# Altium schematic sheet MQTT_SelService_V2.SchDoc
size 419 x 327 mm
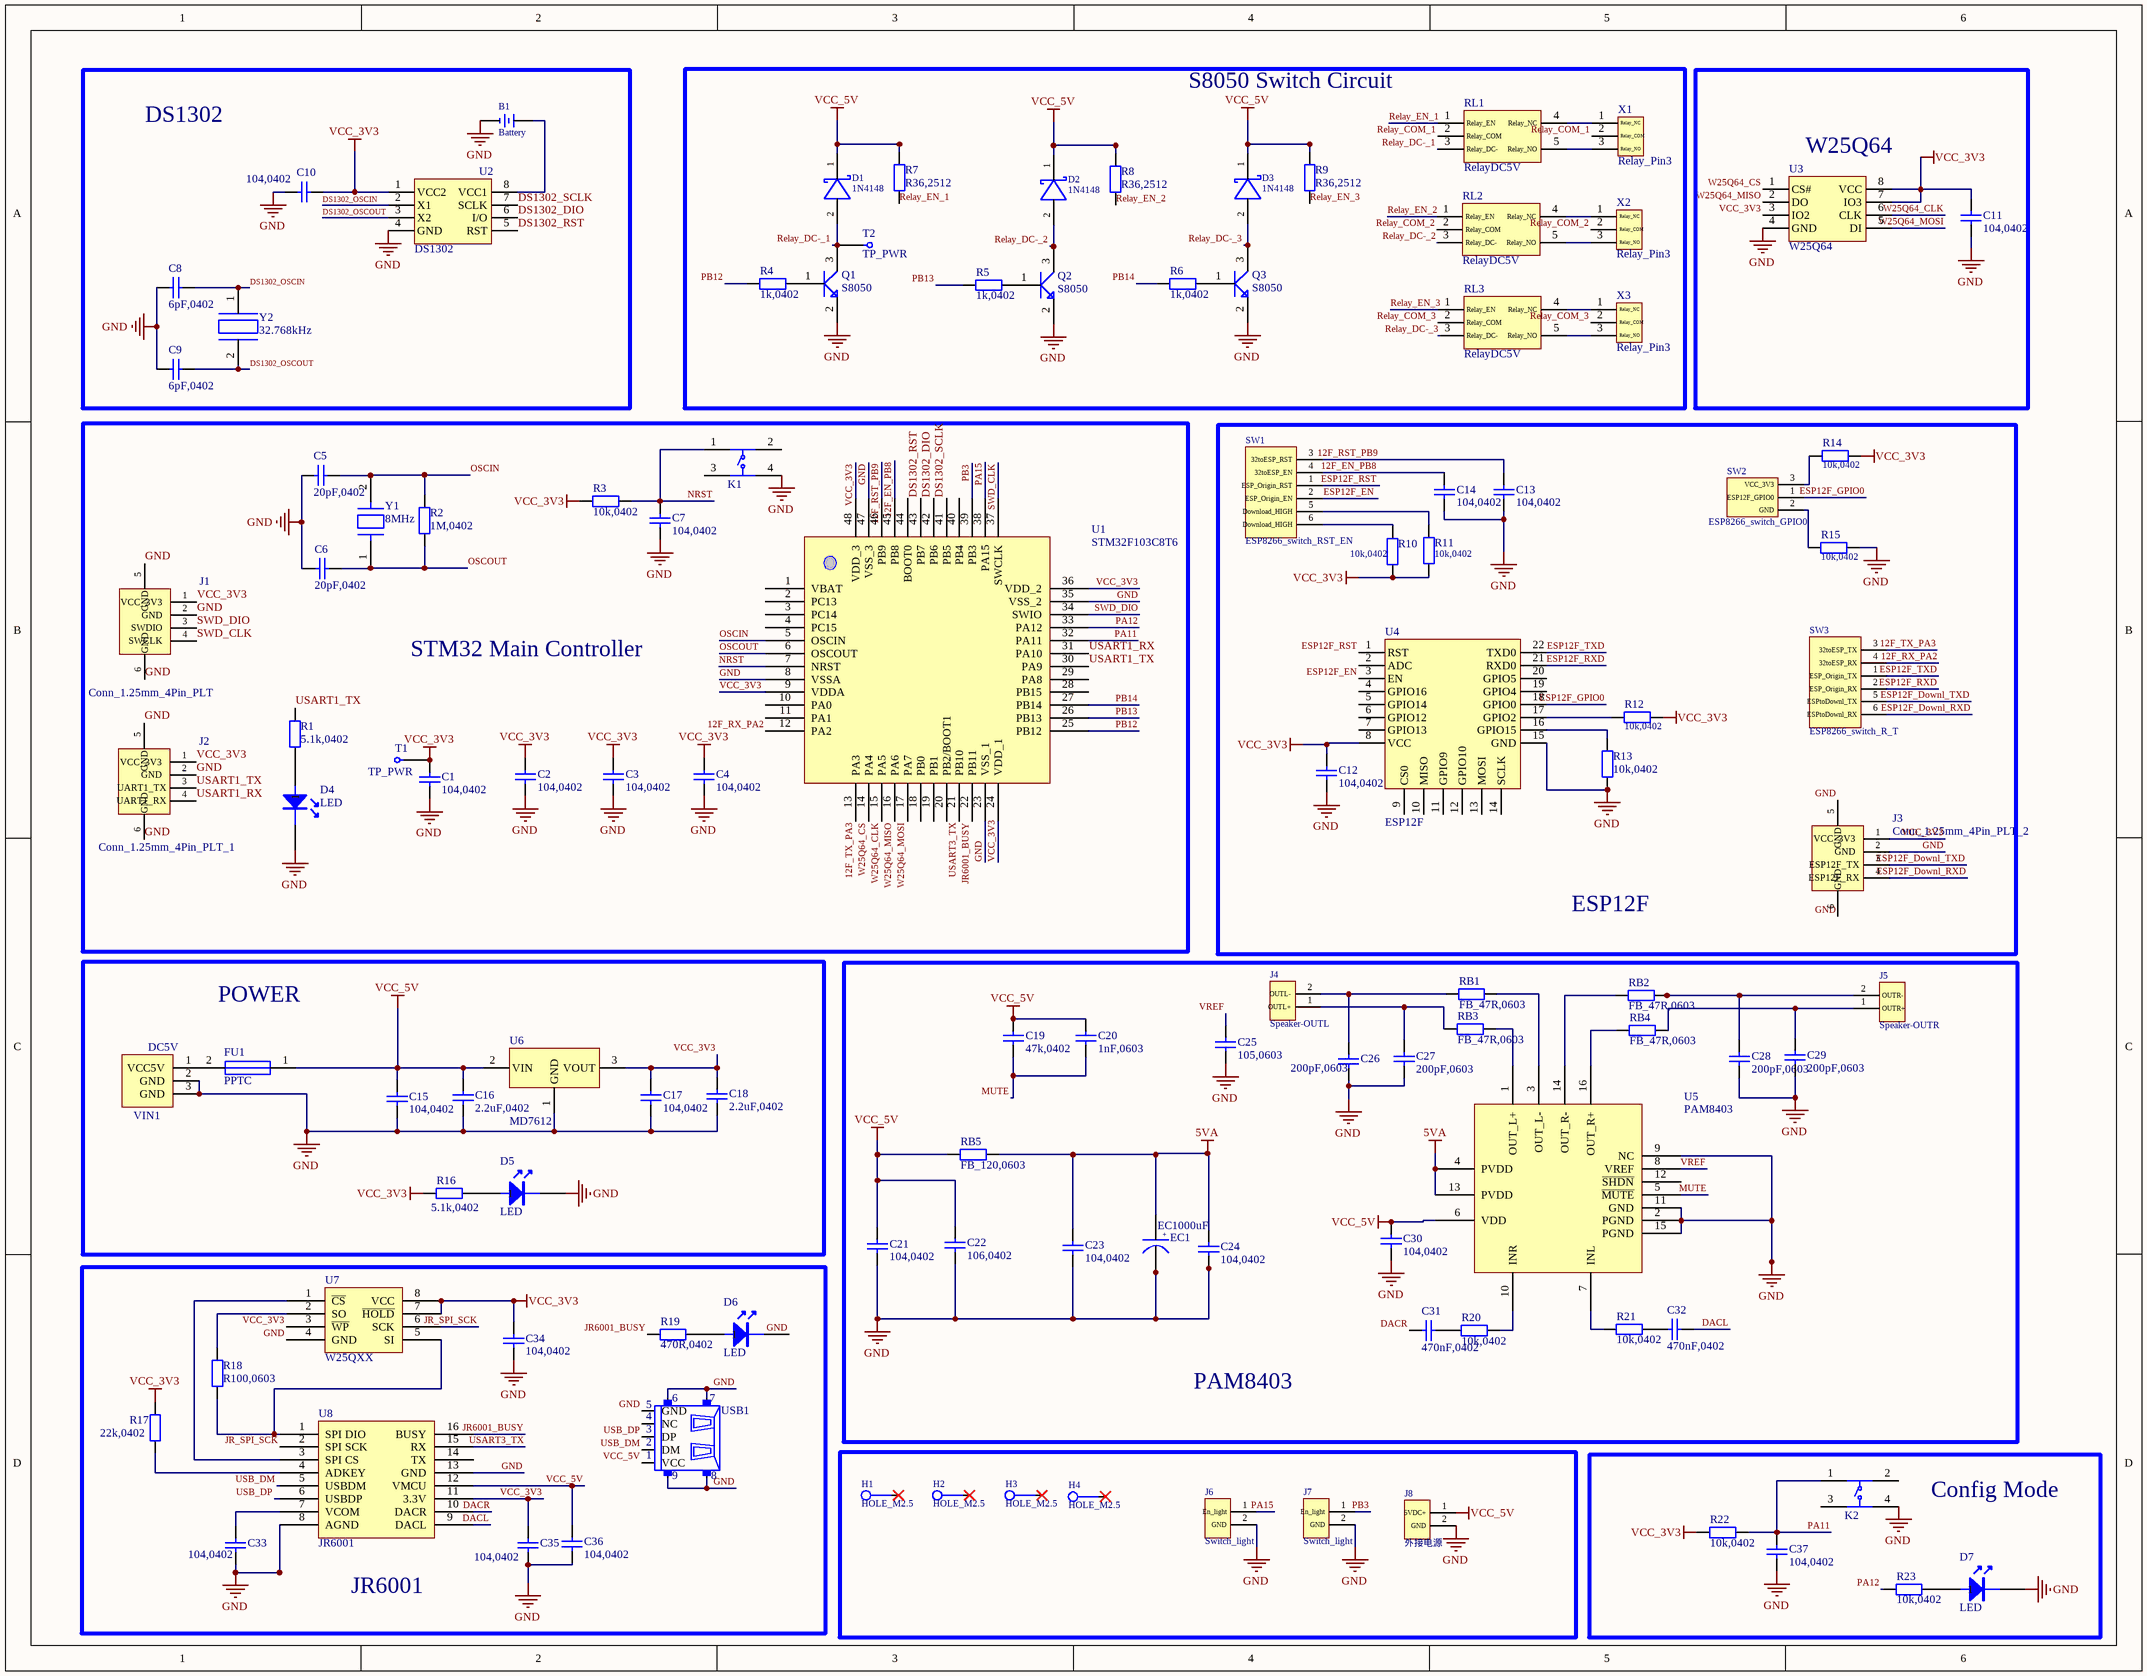
[diagram p0: MQTT_SelService_V2.SchDoc]

## Parts
B1  Battery  [Battery]
C1  104,0402  [C0402]
C2  104,0402  [C0402]
C3  104,0402  [C0402]
C4  104,0402  [C0402]
C5  20pF,0402  [C0402]
C6  20pF,0402  [C0402]
C7  104,0402  [C0402]
C8  6pF,0402  [C0402]
C9  6pF,0402  [C0402]
C10  104,0402  [C0402]
C11  104,0402  [C0402]
C12  104,0402  [C0402]
C13  104,0402  [C0402]
C14  104,0402  [C0402]
C15  104,0402  [C0402]
C16  2.2uF,0402  [C0402]
C17  104,0402  [C0402]
C18  2.2uF,0402  [C0402]
C19  47k,0402  [C0402]
C20  1nF,0603  [C0603]
C21  104,0402  [C0402]
C22  106,0402  [C0402]
C23  104,0402  [C0402]
C24  104,0402  [C0402]
C25  105,0603  [C0603]
C26  200pF,0603  [C0603]
C27  200pF,0603  [C0603]
C28  200pF,0603  [C0603]
C29  200pF,0603  [C0603]
C30  104,0402  [C0402]
C31  470nF,0402  [C0402]
C32  470nF,0402  [C0402]
C33  104,0402  [C0402]
C34  104,0402  [C0402]
C35  104,0402  [C0402]
C36  104,0402  [C0402]
C37  104,0402  [C0402]
D1  1N4148  [1N4148]
D2  1N4148  [1N4148]
D3  1N4148  [1N4148]
D4  LED  [LED0603]
D5  LED  [LED0603]
D6  LED  [LED0603]
D7  LED  [LED0603]
EC1  EC1000uF  [EC1000uF]
FU1  PPTC  [F0805]
H1  HOLE_M2.5  [hole]
H2  HOLE_M2.5  [hole]
H3  HOLE_M2.5  [hole]
H4  HOLE_M2.5  [hole]
J1  Conn_1.25mm_4Pin_PLT  [CONN-SMD_4P-P1.25_HCTL_HC-1.25-4PLT]
J2  Conn_1.25mm_4Pin_PLT_1  [CONN-SMD_4P-P1.25_HCTL_HC-1.25-4PLT]
J3  Conn_1.25mm_4Pin_PLT_2  [CONN-SMD_4P-P1.25_HCTL_HC-1.25-4PLT]
J4  Speaker-OUTL  [XH_2.54mm_2Pin_直插]
J5  Speaker-OUTR  [XH_2.54mm_2Pin_直插]
J6  Switch_light  [XH_2.54mm_2Pin_直插]
J7  Switch_light  [XH_2.54mm_2Pin_直插]
J8  外接电源  [XH_2.54mm_2Pin_直插]
K1  TS665CJ  [SW-TH_4P-L6.0-W6.0-P4.50-LS6.5]  (value not drawn)
K2  TS665CJ  [SW-TH_4P-L6.0-W6.0-P4.50-LS6.5]  (value not drawn)
Q1  S8050  [S8050]
Q2  S8050  [S8050]
Q3  S8050  [S8050]
R1  5.1k,0402  [R0402]
R2  1M,0402  [R0402]
R3  10k,0402  [R0402]
R4  1k,0402  [R0402]
R5  1k,0402  [R0402]
R6  1k,0402  [R0402]
R7  R36,2512  [R2512]
R8  R36,2512  [R2512]
R9  R36,2512  [R2512]
R10  10k,0402  [R0402]
R11  10k,0402  [R0402]
R12  10k,0402  [R0402]
R13  10k,0402  [R0402]
R14  10k,0402  [R0402]
R15  10k,0402  [R0402]
R16  5.1k,0402  [R0402]
R17  22k,0402  [R0402]
R18  R100,0603  [R0603]
R19  470R,0402  [R0402]
R20  10k,0402  [R0402]
R21  10k,0402  [R0402]
R22  10k,0402  [R0402]
R23  10k,0402  [R0402]
RB1  FB_47R,0603  [R0603]
RB2  FB_47R,0603  [R0603]
RB3  FB_47R,0603  [R0603]
RB4  FB_47R,0603  [R0603]
RB5  FB_120,0603  [R0603]
RL1  RelayDC5V  [RelayDC5V]
RL2  RelayDC5V  [RelayDC5V]
RL3  RelayDC5V  [RelayDC5V]
SW1  ESP8266_switch_RST_EN  [switch_TX_RX_toDownload]
SW2  ESP8266_switch_GPIO0  [switch_GPIO0_ESP]
SW3  ESP8266_switch_R_T  [switch_TX_RX_toDownload]
T1  TP_PWR  [TP_PWR]
T2  TP_PWR  [TP_PWR]
U1  STM32F103C8T6  [LQFP-48_L7.0-W7.0-P0.50-LS9.0-BL]
U2  DS1302  [DS1302]
U3  W25Q64  [W25Q64]
U4  ESP12F  [ESP-12E]
U5  PAM8403  [SO-16]
U6  MD7612  [MD71612A]
U7  W25QXX  [W25Qxx]
U8  JR6001  [JR6001]
USB1  USB-5PIN  [MICRO-USB-SMD_MICROXNJ]  (value not drawn)
VIN1  DC5V  [DC5V]  (value not drawn)
X1  Relay_Pin3  [Relay_Pin3_X]
X2  Relay_Pin3  [Relay_Pin3_X]
X3  Relay_Pin3  [Relay_Pin3_X]
Y1  8MHz  [8MHz]
Y2  32.768kHz  [32768Hz]

## Blocks framed on the sheet
DS1302: B1 C8-C10 U2 Y2
S8050 Switch Circuit: D1-D3 Q1-Q3 R4-R9 RL1-RL3 T2 X1-X3
W25Q64: C11 U3
STM32 Main Controller: C1-C7 D4 J1 J2 K1 R1-R3 T1 U1 Y1
ESP12F: C12-C14 J3 R10-R15 SW1-SW3 U4
POWER: C15-C18 D5 FU1 R16 U6 VIN1
PAM8403: C19-C32 EC1 J4 J5 R20 R21 RB1-RB5 U5
JR6001: C33-C36 D6 R17-R19 U7 U8 USB1
Config Mode: C37 D7 K2 R22 R23

## Nets
5VA: C23.2 C24.2 EC1.1 RB5.2 U5.4(PVDD) U5.13(PVDD)
GND: B1.2 C1.1 C2.1 C3.1 C4.1 C5.1 C6.1 C7.1 C8.1 C9.1 C10.1 C11.1 C12.1 C13.1 C14.1 C15.1 C16.1 C17.1 C18.1 C21.1 C22.1 C23.1 C24.1 C25.1 C26.1 C27.1 C28.1 C29.1 C30.1 C33.2 C34.1 C35.1 C36.1 C37.1 D4.2 D5.2 D6.2 D7.2 EC1.2 J1.2(GND) J1.5(GND) J1.6(GND) J2.2(GND) J2.5(GND) J2.6(GND) J3.2(GND) J3.5(GND) J3.6(GND) J6.2(GND) J7.2(GND) J8.2(GND) K1.4 K2.4 Q1.2 Q2.2 Q3.2 R13.1 R15.2 U1.8(VSSA) U1.23(VSS_1) U1.35(VSS_2) U1.47(VSS_3) U2.4(GND) U3.4(GND) U4.15(GND) U5.2(PGND) U5.9(NC) U5.11(GND) U5.15(PGND) U6.1(GND) U7.4(GND) U8.8(AGND) U8.13(GND) USB1.5(GND) USB1.6 USB1.7 USB1.8 USB1.9 VIN1.2(GND) VIN1.3(GND)
VCC_3V3: C1.2 C2.2 C3.2 C4.2 C10.2 C11.2 C12.2 C17.2 C18.2 C34.2 C35.2 J1.1(VCC_3V3) J2.1(VCC_3V3) J3.1(VCC_3V3) R3.2 R10.1 R11.1 R12.2 R14.2 R16.1 R17.2 R22.2 T1.1 U1.9(VDDA) U1.24(VDD_1) U1.36(VDD_2) U1.48(VDD_3) U2.1(VCC2) U3.3(IO2) U3.7(IO3) U3.8(VCC) U4.8(VCC) U6.3(VOUT) U7.3(~{WP}) U7.7(~{HOLD}) U7.8(VCC) U8.11(3.3V)
VCC_5V: C15.2 C16.2 C19.2 C20.2 C21.2 C22.2 C30.2 C36.2 D1.1 D2.1 D3.1 FU1.1 J8.1(5VDC+) R7.2 R8.2 R9.2 RB5.1 U5.6(VDD) U6.2(VIN) U8.12(VMCU) USB1.1(VCC)
12F_EN_PB8: C14.2 SW1.4(32toESP_EN) U1.45(PB8)
12F_RST_PB9: C13.2 SW1.3(32toESP_RST) U1.46(PB9)
12F_RX_PA2: SW3.4(32toESP_RX) U1.12(PA2)
12F_TX_PA3: SW3.3(32toESP_TX) U1.13(PA3)
DACL: C32.2 U8.9(DACL)
DACR: C31.1 U8.10(DACR)
DS1302_DIO: U1.42(PB6) U2.6(I/O)
DS1302_OSCIN: C8.2 U2.2(X1) Y2.1
DS1302_OSCOUT: C9.2 U2.3(X2) Y2.2
DS1302_RST: U1.43(PB7) U2.5(RST)
DS1302_SCLK: U1.41(PB5) U2.7(SCLK)
ESP12F_Downl_RXD: J3.4(ESP12F_RX) SW3.6(ESPtoDownl_RX)
ESP12F_Downl_TXD: J3.3(ESP12F_TX) SW3.5(ESPtoDownl_TX)
ESP12F_EN: SW1.2(ESP_Origin_EN) U4.3(EN)
ESP12F_GPIO0: SW2.1(ESP12F_GPIO0) U4.18(GPIO0)
ESP12F_RST: SW1.1(ESP_Origin_RST) U4.1(RST)
ESP12F_RXD: SW3.2(ESP_Origin_RX) U4.21(RXD0)
ESP12F_TXD: SW3.1(ESP_Origin_TX) U4.22(TXD0)
JR6001_BUSY: R19.1 U1.22(PB11) U8.16(BUSY)
JR_SPI_SCK: U7.6(SCK) U8.2(SPI_SCK)
MUTE: C19.1 C20.1 U5.5(~{MUTE})
NRST: C7.2 K1.1 R3.1 U1.7(NRST)
OSCIN: C5.2 R2.2 U1.5(OSCIN) Y1.2
OSCOUT: C6.2 R2.1 U1.6(OSCOUT) Y1.1
PA11: C37.2 K2.1 R22.1 U1.32(PA11)
PA12: R23.1 U1.33(PA12)
PA15: J6.1(En_light) U1.38(PA15)
PB3: J7.1(En_light) U1.39(PB3)
PB12: R4.1 U1.25(PB12)
PB13: R5.1 U1.26(PB13)
PB14: R6.1 U1.27(PB14)
Relay_COM_1: RL1.2(Relay_COM) X1.2(Relay_COM)
Relay_COM_2: RL2.2(Relay_COM) X2.2(Relay_COM)
Relay_COM_3: RL3.2(Relay_COM) X3.2(Relay_COM)
Relay_DC-_1: D1.2 Q1.3 RL1.3(Relay_DC-) T2.1
Relay_DC-_2: D2.2 Q2.3 RL2.3(Relay_DC-)
Relay_DC-_3: D3.2 Q3.3 RL3.3(Relay_DC-)
Relay_EN_1: R7.1 RL1.1(Relay_EN)
Relay_EN_2: R8.1 RL2.1(Relay_EN)
Relay_EN_3: R9.1 RL3.1(Relay_EN)
SWD_CLK: J1.4(SWCLK) U1.37(SWCLK)
SWD_DIO: J1.3(SWDIO) U1.34(SWIO)
USART1_RX: J2.4(UART1_RX) U1.31(PA10)
USART1_TX: J2.3(UART1_TX) R1.2 U1.30(PA9)
USART3_TX: U1.21(PB10) U8.15(RX)
USB_DM: U8.5(USBDM) USB1.2(DM)
USB_DP: U8.6(USBDP) USB1.3(DP)
VREF: C25.2 U5.8(VREF)
W25Q64_CLK: U1.15(PA5) U3.6(CLK)
W25Q64_CS: U1.14(PA4) U3.1(CS#)
W25Q64_MISO: U1.16(PA6) U3.2(DO)
W25Q64_MOSI: U1.17(PA7) U3.5(DI)
NetB1_1: B1.1 U2.8(VCC1)
NetC26_2: C26.2 J4.2(OUTL-) RB1.1
NetC27_2: C27.2 J4.1(OUTL+) RB3.1
NetC28_2: C28.2 J5.2(OUTR-) RB2.2
NetC29_2: C29.2 J5.1(OUTR+) RB4.2
NetC31_2: C31.2 R20.1
NetC32_1: C32.1 R21.2
NetC33_1: C33.1 U8.7(VCOM)
NetD4_1: D4.1 R1.1
NetD5_1: D5.1 R16.2
NetD6_1: D6.1 R19.2
NetD7_1: D7.1 R23.2
NetFU1_2: FU1.2 VIN1.1(VCC5V)
NetQ1_1: Q1.1 R4.2
NetQ2_1: Q2.1 R5.2
NetQ3_1: Q3.1 R6.2
NetR10_2: R10.2 SW1.6(Download_HIGH)
NetR11_2: R11.2 SW1.5(Download_HIGH)
NetR12_1: R12.1 U4.17(GPIO2)
NetR13_2: R13.2 U4.16(GPIO15)
NetR14_1: R14.1 SW2.3(VCC_3V3)
NetR15_1: R15.1 SW2.2(GND)
NetR17_1: R17.1 U8.4(ADKEY)
NetR18_1: R18.1 U7.5(SI) U8.1(SPI_DIO)
NetR18_2: R18.2 U7.2(SO)
NetR20_2: R20.2 U5.10(INR)
NetR21_1: R21.1 U5.7(INL)
NetRB1_2: RB1.2 U5.3(OUT_L-)
NetRB2_1: RB2.1 U5.14(OUT_R-)
NetRB3_2: RB3.2 U5.1(OUT_L+)
NetRB4_1: RB4.1 U5.16(OUT_R+)
NetRL1_4: RL1.4(Relay_NC) X1.1(Relay_NC)
NetRL1_5: RL1.5(Relay_NO) X1.3(Relay_NO)
NetRL2_4: RL2.4(Relay_NC) X2.1(Relay_NC)
NetRL2_5: RL2.5(Relay_NO) X2.3(Relay_NO)
NetRL3_4: RL3.4(Relay_NC) X3.1(Relay_NC)
NetRL3_5: RL3.5(Relay_NO) X3.3(Relay_NO)
NetU7_1: U7.1(~{CS}) U8.3(SPI_CS)

Not connected (* = marked no-connect by the designer): H1 1*; H2 1*; H3 1*; H4 1*; K1 2 3; K2 2 3; U1 1(VBAT) 2(PC13) 3(PC14) 4(PC15) 10(PA0) 11(PA1) 18(PB0) 19(PB1) 20(PB2/BOOT1) 28(PB15) 29(PA8) 40(PB4) 44(BOOT0); U4 2(ADC) 4(GPIO16) 5(GPIO14) 6(GPIO12) 7(GPIO13) 9(CS0) 10(MISO) 11(GPIO9) 12(GPIO10) 13(MOSI) 14(SCLK) 19(GPIO4) 20(GPIO5); U5 12(~{SHDN}); U8 14(TX); USB1 4(NC)

## Notes on the sheet
- (in symbol EC) +

## Library data of the parts
B1 = Battery: V_Backup
C1-C4 C7 C10-C15 C17 C21 C23 C24 C30 C33-C37 = Cap1: Value: 104; Published: 8-Jun-2000; LatestRevisionDate: 17-Jul-2002; LatestRevisionNote: Re-released for DXP Platform.; Publisher: Altium Limited
C5 C6 = Cap0402_3: Value: 104; Published: 8-Jun-2000; LatestRevisionDate: 17-Jul-2002; LatestRevisionNote: Re-released for DXP Platform.; Publisher: Altium Limited
C8 C9 = Cap0402_2: Value: 104; Published: 8-Jun-2000; LatestRevisionDate: 17-Jul-2002; LatestRevisionNote: Re-released for DXP Platform.; Publisher: Altium Limited
C16 C18 = C2.2uF: Value: 104; Published: 8-Jun-2000; LatestRevisionDate: 17-Jul-2002; LatestRevisionNote: Re-released for DXP Platform.; Publisher: Altium Limited
C19 C22 = Cap1: 104,0402; Value: 104; Published: 8-Jun-2000; LatestRevisionDate: 17-Jul-2002; LatestRevisionNote: Re-released for DXP Platform.; Publisher: Altium Limited
C20 = C1nF: Value: 104; Published: 8-Jun-2000; LatestRevisionDate: 17-Jul-2002; LatestRevisionNote: Re-released for DXP Platform.; Publisher: Altium Limited
C25 = Cap2: Value: 104; Published: 8-Jun-2000; LatestRevisionDate: 17-Jul-2002; LatestRevisionNote: Re-released for DXP Platform.; Publisher: Altium Limited
C26-C29 = C200pF: Value: 104; Published: 8-Jun-2000; LatestRevisionDate: 17-Jul-2002; LatestRevisionNote: Re-released for DXP Platform.; Publisher: Altium Limited
C31 C32 = C470nF: Value: 104; Published: 8-Jun-2000; LatestRevisionDate: 17-Jul-2002; LatestRevisionNote: Re-released for DXP Platform.; Publisher: Altium Limited
D1-D3 = 1N4148: SOD-123
EC1 = EC: 1000uF
J1 = Conn_1.25mm_4Pin_PLT: SWD_Conn
J2 = Conn_1.25mm_4Pin_PLT_1: USART_Conn
J3 = Conn_1.25mm_4Pin_PLT_2: ESP_Downl_Conn
J6 J7 = Switch_light: 2.54mm,直插
J8 = 外接电源: 2.54mm
K1 K2 = TS665CJ: 矩阵按键
R1 R4-R6 R16 R19 = R10k: 10k,0402; Published: 8-Jun-2000; LatestRevisionDate: 17-Jul-2002; LatestRevisionNote: Re-released for DXP Platform.; Publisher: Altium Limited
R2 = R1M: Published: 8-Jun-2000; LatestRevisionDate: 17-Jul-2002; LatestRevisionNote: Re-released for DXP Platform.; Publisher: Altium Limited
R3 R22 = R1M: 10,0402; Published: 8-Jun-2000; LatestRevisionDate: 17-Jul-2002; LatestRevisionNote: Re-released for DXP Platform.; Publisher: Altium Limited
R10-R15 R20 R21 R23 = R10k: Published: 8-Jun-2000; LatestRevisionDate: 17-Jul-2002; LatestRevisionNote: Re-released for DXP Platform.; Publisher: Altium Limited
R17 = R22k: Published: 8-Jun-2000; LatestRevisionDate: 17-Jul-2002; LatestRevisionNote: Re-released for DXP Platform.; Publisher: Altium Limited
R18 = R100: 0603; Published: 8-Jun-2000; LatestRevisionDate: 17-Jul-2002; LatestRevisionNote: Re-released for DXP Platform.; Publisher: Altium Limited
RB1-RB4 = FB_47R: Published: 8-Jun-2000; LatestRevisionDate: 17-Jul-2002; LatestRevisionNote: Re-released for DXP Platform.; Publisher: Altium Limited
RB5 = FB_120: Published: 8-Jun-2000; LatestRevisionDate: 17-Jul-2002; LatestRevisionNote: Re-released for DXP Platform.; Publisher: Altium Limited
U3 = W25Q64: withMaster
U6 = MD7612A33PA1: SOT-89
U7 = W25QXX: withJR6001
USB1 = USB-5PIN: withJR6001
R7-R9 = R36,2512: Published: 8-Jun-2000; LatestRevisionDate: 17-Jul-2002; LatestRevisionNote: Re-released for DXP Platform.; Publisher: Altium Limited